# EAGLE design brd-relays (EAGLE 6.5.0)
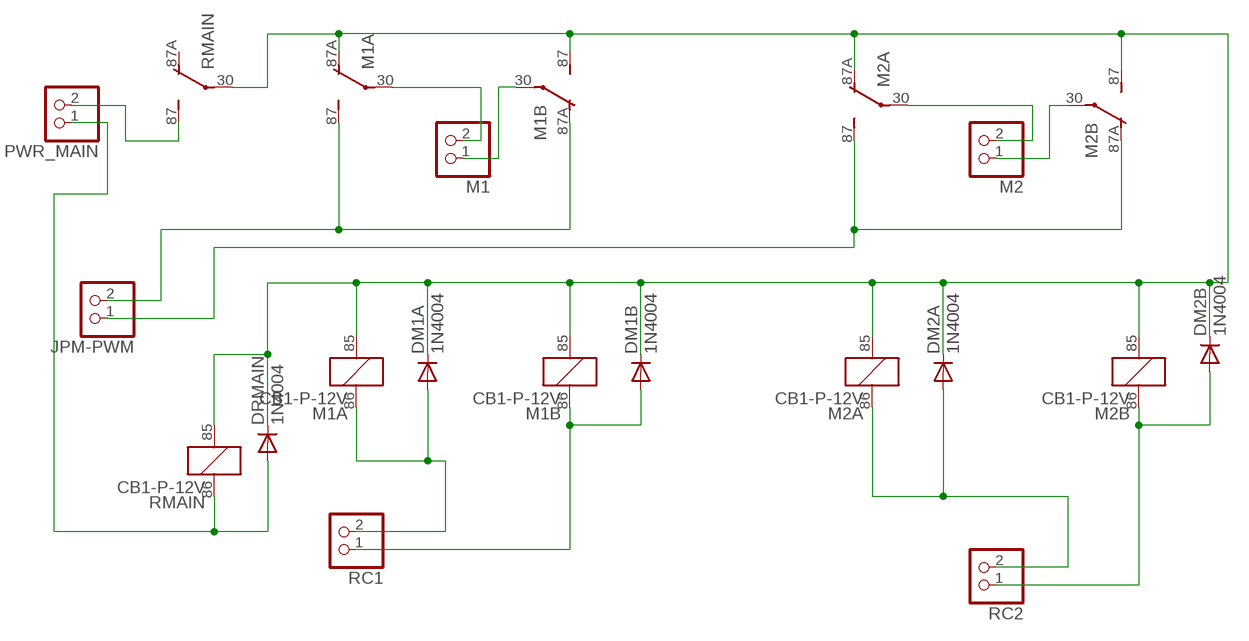
[diagram p0: schematic, sheet 1]

## Parts
DM1A  1N4004  [DO41-10]
DM1B  1N4004  [DO41-10]
DM2A  1N4004  [DO41-10]
DM2B  1N4004  [DO41-10]
DRMAIN  1N4004  [DO41-10]
JPM-PWM  PINHD-1X22X1-BIG  [1X02]
M1  PINHD-1X22X1-BIG  [1X02]
M1A  CB1-P-12V  [CB1]
M1B  CB1-P-12V  [CB1]
M2  PINHD-1X22X1-BIG  [1X02]
M2A  CB1-P-12V  [CB1]
M2B  CB1-P-12V  [CB1]
PWR_MAIN  PINHD-1X22X1-BIG  [1X02]
RC1  PINHD-1X22X1-BIG  [1X02]
RC2  PINHD-1X22X1-BIG  [1X02]
RMAIN  CB1-P-12V  [CB1]

## Nets
N$1: DM1A.C DM1B.C DM2A.C DM2B.C DRMAIN.C M1A.85 M1A.87A(2:O) M1B.85 M1B.87(2:S) M2A.85 M2A.87A(2:O) M2B.85 M2B.87(2:S) RMAIN.30(2:P) RMAIN.85
N$2: M1.2 M1A.30(2:P)
N$3: M1.1 M1B.30(2:P)
N$4: PWR_MAIN.2 RMAIN.87(2:S)
N$5: JPM-PWM.2 M1A.87(2:S) M1B.87A(2:O)
N$7: M2.2 M2A.30(2:P)
N$8: M2.1 M2B.30(2:P)
N$9: DM1A.A M1A.86 RC1.2
N$10: DM1B.A M1B.86 RC1.1
N$11: DM2A.A M2A.86 RC2.2
N$12: DM2B.A M2B.86 RC2.1
N$13: JPM-PWM.1 M2A.87(2:S) M2B.87A(2:O)
N$14: DRMAIN.A PWR_MAIN.1 RMAIN.86
Unconnected: RMAIN.87A(2:O)

## Library data of the parts
DM1A DM1B DM2A DM2B DRMAIN = diode:1N4004: DIODE general purpose rectifier, 1 A
JPM-PWM M1 M2 PWR_MAIN RC1 RC2 = dbg-misc:PINHD-1X2: PIN HEADER
M1A M1B M2A M2B RMAIN = dbg-misc:CB1*: HIGH POWER AUTOMOTIVE RELAY Form C NAiS Source: http://www.mew-europe.com/.. en_ds_61202_0000.pdf; MF: AROMAT/ MATSUSHITA; MPN: CB1-P-12V; OC_FARNELL: unknown; OC_NEWARK: 52F9201

## Board
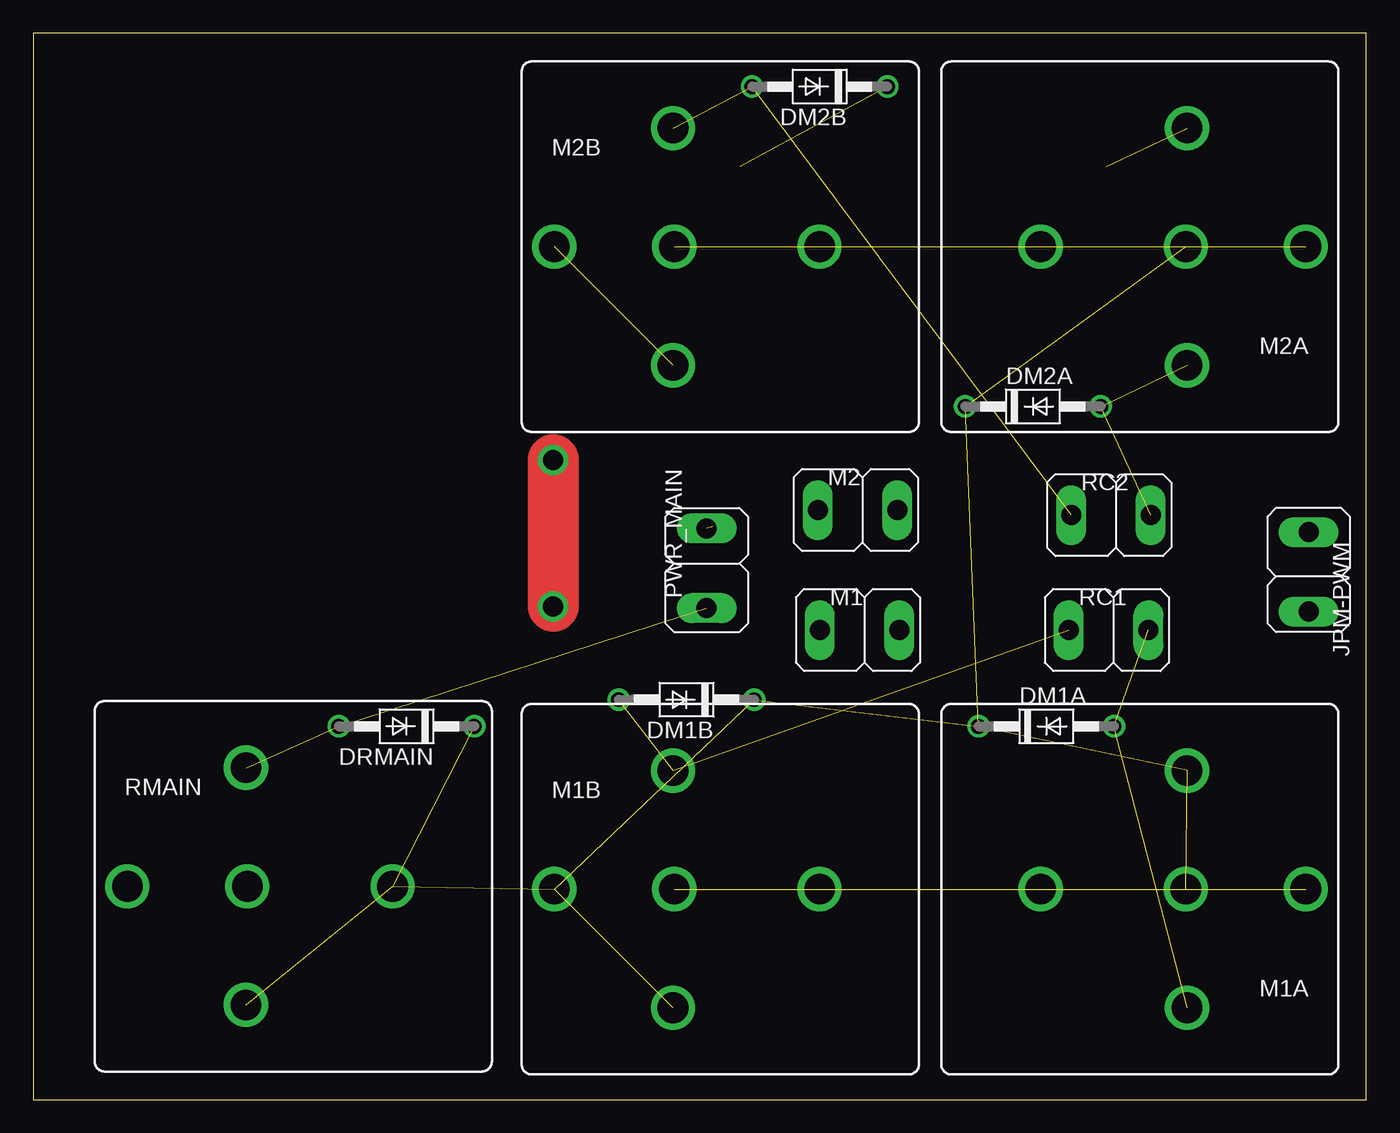
[diagram p1: board, top side]
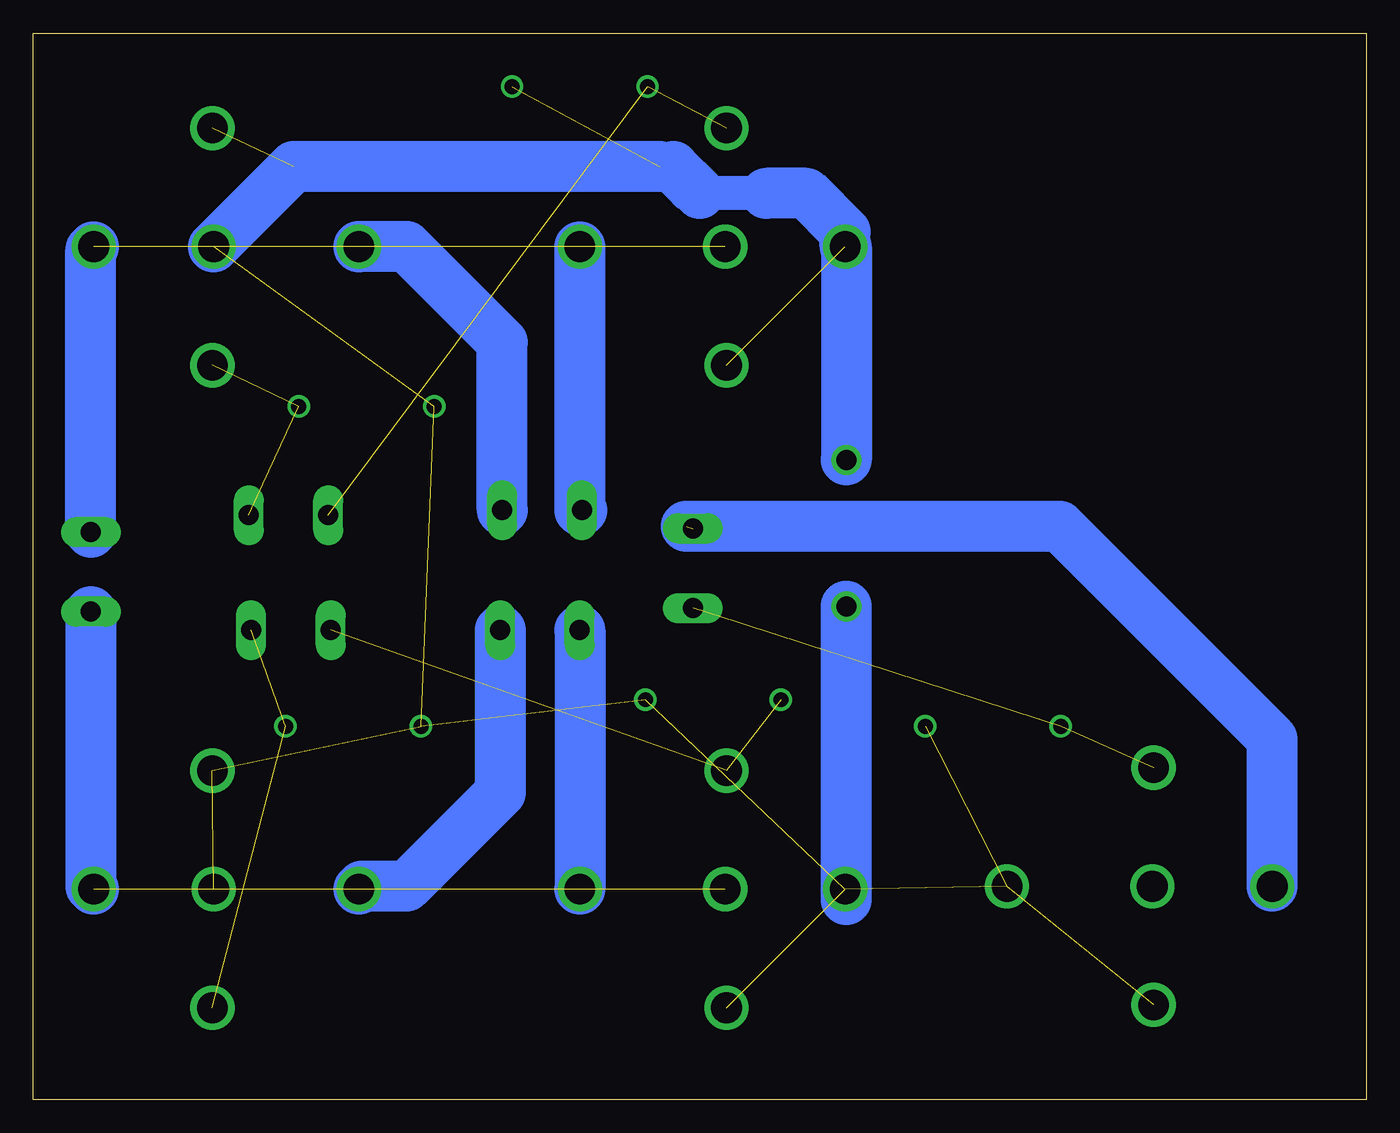
[diagram p2: board, bottom side, seen from below]

Size 100 x 80 mm. Coordinates in mm from the lower left corner, seen from the top.
Outline: 0,0 100,0 100,80 0,80 0,0
Copper layers (1*16): Top 0.035mm / dielectric 1.5mm / Bottom 0.035mm
Design rules "default": minimum track width 10mil, minimum drill 24mil, track to track 8mil, track to pad 8mil, pad to pad 8mil, via to via 8mil, smd to smd 8mil, copper to edge 40mil, drill to drill 8mil, minimum pad ring 10mil, minimum via ring 8mil, stop-mask expansion 4mil, vias tented up to drill 0mil, thermal gap 10mil

### Footprints (pad centres in the part's own frame; a part is rotated, then mirrored left to right if it is on the bottom)
DO41-10 = drill 1.118: A 5.08,0; C -5.08,0
1X02 = drill 1.5 long: 1 -3.35,0; 2 2.62,0
CB1 = drill 2.3: 30 9.95,-3; 85 -1.05,-11.9; 86 -1.05,5.9; 87 -9.95,-3; 87A -0.95,-3

### Placement (x,y rotation side)
DM1A  76,28 0 top
DM1B  49,30 180 top
DM2A  75,52 0 top
DM2B  59,76 180 top
DRMAIN  28,28 180 top
JPM-PWM  95.68,39.23 270 top
M1  62.36,35.23 0 top
M1A  85.52,12.78 180 top
M1B  49.04,18.78 0 top
M2  62.2,44.23 0 top
M2A  85.52,60.99 180 top
M2B  49.04,66.99 0 top
PWR_MAIN  50.52,40.23 90 top
RC1  81.04,35.23 0 top
RC2  81.22,43.85 0 top
RMAIN  17,19 0 top

### Tracks (layer width: path | path; a pad name or v marks a point on that pad's centre or on a via)
N$1  (13 unrouted)
  Bottom 2.54: 45,68 50,68 51,68 53,70
  Bottom 3.81: M2B.87 39.09,65.09 42,68 45,68 | 53,70 80.46,70 M2A.87A | 50,68 52,70
N$2
  Bottom 3.81: M1.2 64.98,23.02 72,16 75.35,16 M1A.30
N$3
  Bottom 3.81: M1.1 58.99,35.23 M1B.30
N$4  (1 unrouted)
  Bottom 3.81: RMAIN.87 7.05,27.05 23,43 51,43
N$5  (1 unrouted)
  Bottom 3.81: JPM-PWM.2 95.68,15.99 M1A.87
N$7
  Bottom 3.81: M2.2 64.82,56.82 72,64 M2A.30
N$8
  Bottom 3.81: M2.1 58.99,44.23 M2B.30
N$9  (2 unrouted)
N$10  (2 unrouted)
N$11  (2 unrouted)
N$12  (2 unrouted)
N$13  (1 unrouted)
  Bottom 3.81: JPM-PWM.1 95.68,63.78 M2A.87
N$14  (2 unrouted)
N$16  (via drill 1.5)
  Top 3.81: v39,48 v39,37
  Bottom 3.81: 39,64 v39,48 | 39,15 v39,37